# EAGLE design sphinkter (EAGLE 6.5.0)
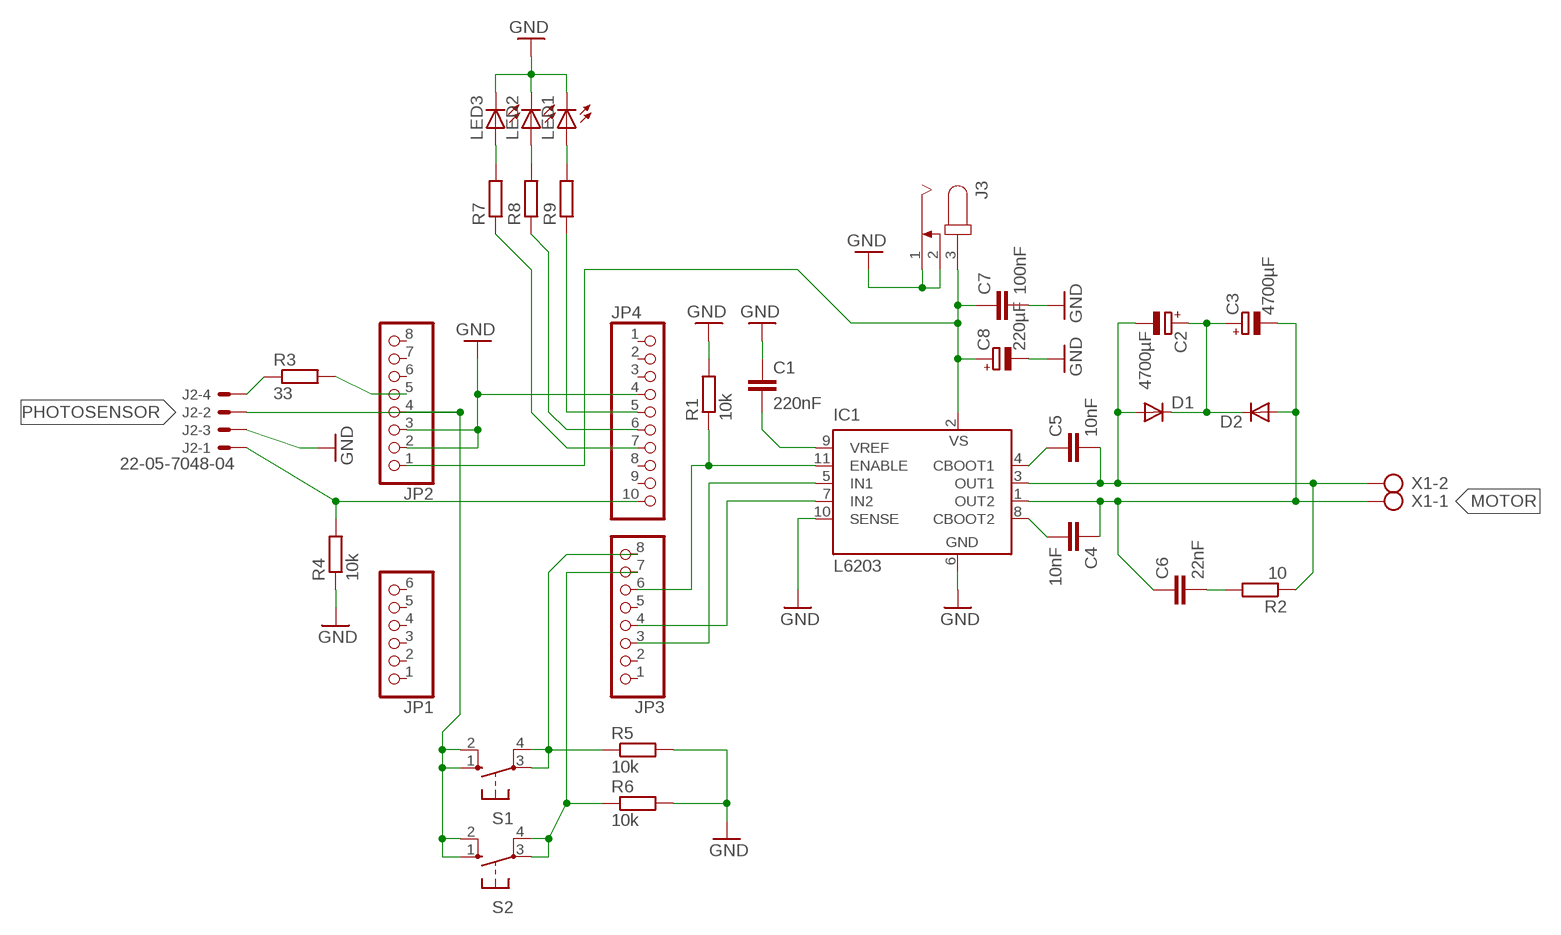
[diagram p0: schematic, sheet 1]

## Parts
C1  220nF  C-EU050-024X044  [C050-024X044]
C2  4700µF  CPOL-EUE7.5-16  [E7,5-16]
C3  4700µF  CPOL-EUE7.5-16  [E7,5-16]
C4  10nF  C-EU025-025X050  [C025-025X050]
C5  10nF  C-EU025-025X050  [C025-025X050]
C6  22nF  C-EU050-024X044  [C050-024X044]
C7  100nF  C-EU050-024X044  [C050-024X044]
C8  220µF  CPOL-EUE3.5-8  [E3,5-8]
D1  DIODE-DO27-15  [DO27-15]
D2  DIODE-DO27-15  [DO27-15]
IC1  L6203  [MULTIWATT-11]
J2  22-05-7048-04  [7395-04]
J3  JACK-PLUG0  [SPC4077]
JP1  PINHD-1X6  [1X06]
JP2  PINHD-1X8  [1X08]
JP3  PINHD-1X8  [1X08]
JP4  PINHD-1X10  [1X10]
LED1  LED5MM  [LED5MM]
LED2  LED5MM  [LED5MM]
LED3  LED5MM  [LED5MM]
R1  10k  R-EU_0207/10  [0207/10]
R2  10  R-EU_0207/10  [0207/10]
R3  33  R-EU_0207/10  [0207/10]
R4  10k  R-EU_0207/10  [0207/10]
R5  10k  R-EU_0207/10  [0207/10]
R6  10k  R-EU_0207/10  [0207/10]
R7  R-EU_0207/10  [0207/10]
R8  R-EU_0207/10  [0207/10]
R9  R-EU_0207/10  [0207/10]
S1  10-XX  [B3F-10XX]
S2  10-XX  [B3F-10XX]
X1  AK500/2  [AK500/2]

## Nets
5V_DETECTOR: JP2.5 R3.2
GND: C1.1 C7.2 C8.- IC1.6(GND) IC1.10(SENSE) J2.3 J3.1 J3.2 JP2.2 JP2.3 JP4.4 LED1.K(C) LED2.K(C) LED3.K(C) R1.2 R4.1 R5.2 R6.2
MOTOR: C3.- C4.1 C6.1 D2.A IC1.1(OUT2) X1.1
N$1: C1.2 IC1.9(VREF)
N$2: IC1.7(IN2) JP3.4
N$3: IC1.5(IN1) JP3.3
N$4: IC1.11(ENABLE) JP3.6 R1.1
N$5: C7.1 C8.+ IC1.2(VS) J3.3 JP2.1
N$6: C2.+ C3.+ D1.C D2.C
N$7: C4.2 IC1.8(CBOOT2)
N$8: C5.1 IC1.4(CBOOT1)
N$11: C6.2 R2.2
N$12: C2.- C5.2 D1.A IC1.3(OUT1) R2.1 X1.2
N$14: JP3.8 R5.1 S1.3(P) S1.4(P1)
N$16: JP3.7 R6.1 S2.3(P) S2.4(P1)
N$17: JP4.5 R9.1
N$18: LED3.A R7.2
N$19: LED2.A R8.2
N$20: LED1.A R9.2
N$21: JP4.6 R8.1
N$22: JP4.7 R7.1
N$24: J2.4 R3.1
PHOTOSENSOR: J2.2 JP2.4 S1.1(S) S1.2(S1) S2.1(S) S2.2(S1)
TO_ARDUINO: J2.1 JP4.10 R4.2
Unconnected: JP1.1 JP1.2 JP1.3 JP1.4 JP1.5 JP1.6 JP2.6 JP2.7 JP2.8 JP3.1 JP3.2 JP3.5 JP4.1 JP4.2 JP4.3 JP4.8 JP4.9

## Library data of the parts
C1 = rcl:C-EU: CAPACITOR, European symbol
C2 C3 C8 = resistor:CPOL-EU: POLARIZED CAPACITOR, European symbol
C4-C7 = resistor:C-EU: CAPACITOR, European symbol
D1 D2 = diode:DIODE-: DIODE
IC1 = st-microelectronics:L6203: DMOS FULL BRIDGE DRIVER; MPN: L6203; OC_FARNELL: 1467715; OC_NEWARK: 56P8434
J2 = con-molex:22-?-04: CONNECTOR wire to board 2.54 mm (.1 inch) pitch header; OC_FARNELL: unknown; OC_NEWARK: unknown
J3 = con-jack:JACK-PLUG: DC POWER JACK Power Jack, DC, Right Angle, Through Hole, Rated 5A at 16VDC, PC Terminals Distributor: Farnell (www.Farnell.de) Drawing: 84N1161.pdf / 84N1162.pdf Manufacturer: SPC Technology (www.spctechnology.com) Type: SPC4077 / SPC 4078; OC_FARNELL: unknown; OC_NEWARK: unknown
JP1 = pinhead:PINHD-1X6: PIN HEADER
JP2 JP3 = pinhead:PINHD-1X8: PIN HEADER
JP4 = pinhead:PINHD-1X10: PIN HEADER
LED1-LED3 = led:LED: LED OSRAM: - CHIPLED LG R971, LG N971, LY N971, LG Q971, LY Q971, LO R971, LY R971 LH N974, LH R974 LS Q976, LO Q976, LY Q976 LO Q996 - Hyper CHIPLED LW Q18S LB Q993, LB Q99A, LB R99A - SideLED LS A670, LO A670, LY A670, LG A670, LP A670 LB A673, LV A673, LT A673, LW A673 LH A674 LY A675 LS A676, LA A676, LO A676, LY A676, LW A676 LS A679, LY A679, LG A679 - Hyper Micro SIDELED® LS Y876, LA Y876, LO Y876, LY Y876 LT Y87S - SmartLED LW L88C, LW L88S LB L89C, LB L89S, LG L890 LS L89K, LO L89K, LY L89K LS L896, LA L896, LO L896, LY L896 - TOPLED LS T670, LO T670, LY T670, LG T670, LP T670 LSG T670, LSP T670, LSY T670, LOP T670, LYG T670 LG T671, LOG T671, LSG T671 LB T673, LV T673, LT T673, LW T673 LH T674 LS T676, LA T676, LO T676, LY T676, LB T676, LH T676, LSB T676, LW T676 LB T67C, LV T67C, LT T67C, LS T67K, LO T67K, LY T67K, LW E67C LS E67B, LA E67B, LO E67B, LY E67B, LB E67C, LV E67C, LT E67C LW T67C LS T679, LY T679, LG T679 LS T770, LO T770, LY T770, LG T770, LP T770 LB T773, LV T773, LT T773, LW T773 LH T774 LS E675, LA E675, LY E675, LS T675 LS T776, LA T776, LO T776, LY T776, LB T776 LHGB T686 LT T68C, LB T68C - Hyper Mini TOPLED® LB M676 - Mini TOPLED Santana® LG M470 LS M47K, LO M47K, LY M47K Source: http://www.osram.convergy.de LUXEON: - LUMILED® LXK2-PW12-R00, LXK2-PW12-S00, LXK2-PW14-U00, LXK2-PW14-V00 LXK2-PM12-R00, LXK2-PM12-S00, LXK2-PM14-U00 LXK2-PE12-Q00, LXK2-PE12-R00, LXK2-PE12-S00, LXK2-PE14-T00, LXK2-PE14-U00 LXK2-PB12-K00, LXK2-PB12-L00, LXK2-PB12-M00, LXK2-PB14-N00, LXK2-PB14-P00, LXK2-PB14-Q00 LXK2-PR12-L00, LXK2-PR12-M00, LXK2-PR14-Q00, LXK2-PR14-R00 LXK2-PD12-Q00, LXK2-PD12-R00, LXK2-PD12-S00 LXK2-PH12-R00, LXK2-PH12-S00 LXK2-PL12-P00, LXK2-PL12-Q00, LXK2-PL12-R00 Source: www.luxeon.com KINGBRIGHT: KA-3528ASYC Source: www.kingbright.com
R1-R9 = resistor:R-EU_: RESISTOR, European symbol
S1 S2 = switch-omron:10-XX: OMRON SWITCH; MPN: B3F-1000; OC_FARNELL: 176432; OC_NEWARK: 36M3542
X1 = con-ptr500:AK500/2: CONNECTOR; OC_FARNELL: unknown; OC_NEWARK: unknown

## Net classes
0 signal: width 0.5 mm
1 energy: width 1.5 mm

## Board
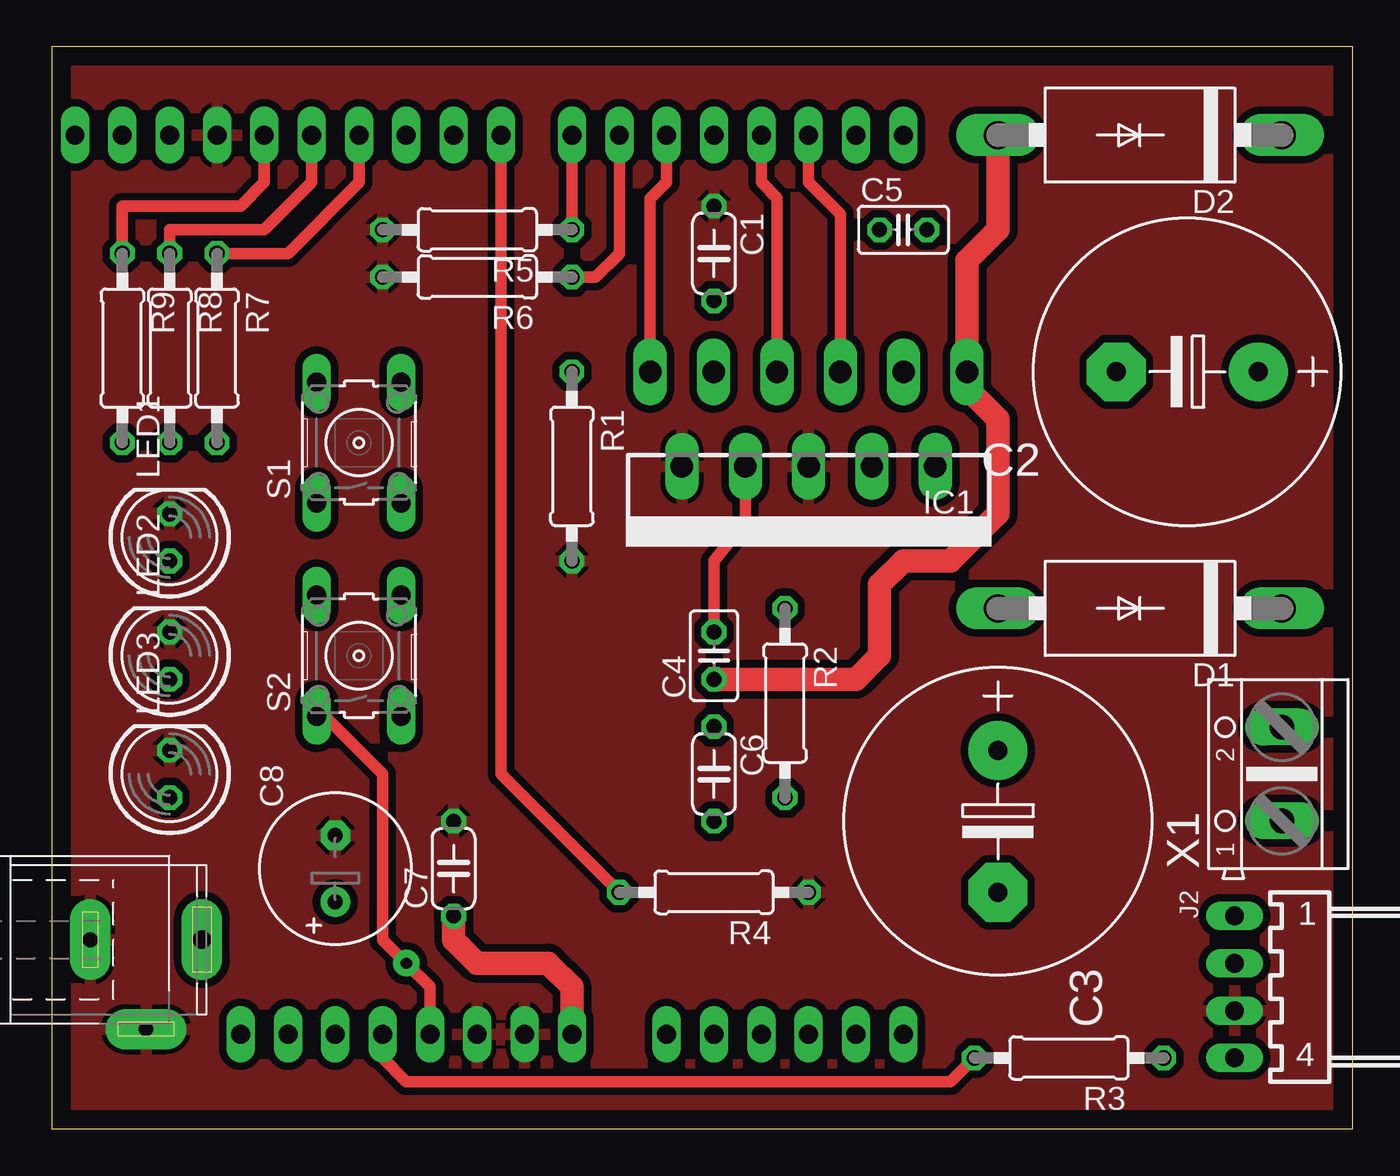
[diagram p1: board, top side]
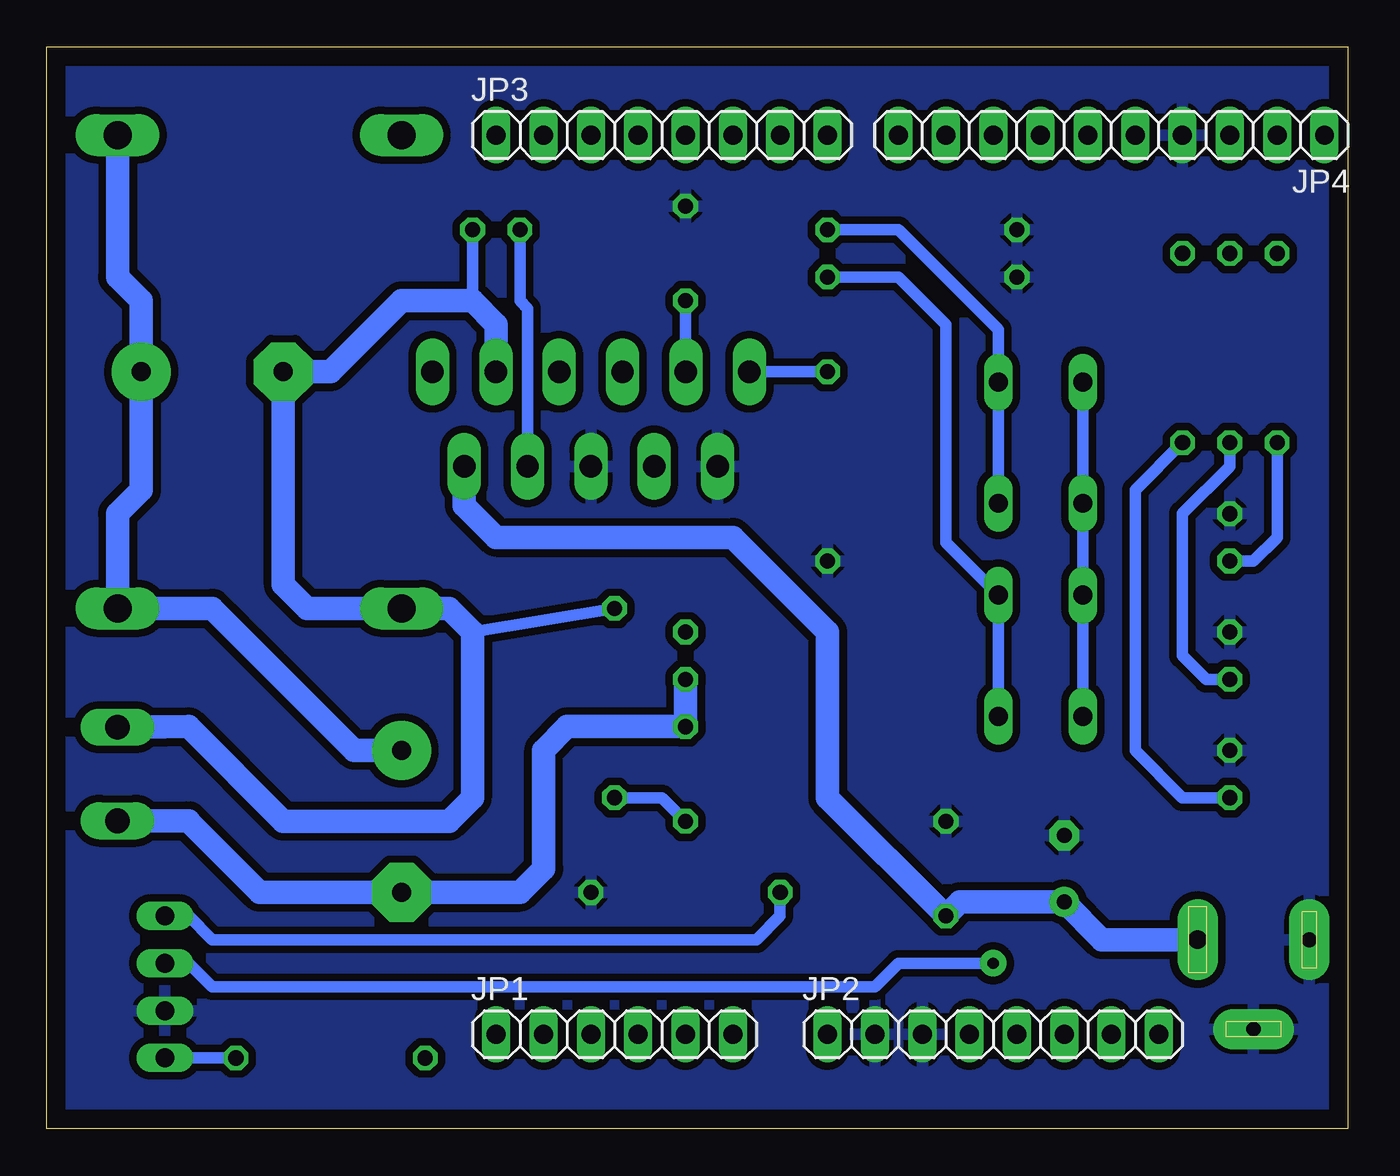
[diagram p2: board, bottom side, seen from below]

Size 69.84 x 58.09 mm. Coordinates in mm from the lower left corner, seen from the top.
Outline: 69.84,0 69.84,58.09 0,58.09 0,0 69.84,0
Copper layers (1*16): Top 0.035mm / dielectric 1.5mm / Bottom 0.035mm
Design rules "default": minimum track width 10mil, minimum drill 24mil, track to track 8mil, track to pad 8mil, pad to pad 8mil, via to via 8mil, smd to smd 8mil, copper to edge 40mil, drill to drill 8mil, minimum pad ring 10mil, minimum via ring 8mil, stop-mask expansion 4mil, vias tented up to drill 0mil, thermal gap 10mil

### Footprints (pad centres in the part's own frame; a part is rotated, then mirrored left to right if it is on the bottom)
C050-024X044 = drill 0.813 octagon: 1 -2.54,0; 2 2.54,0
E7,5-16 = drill 1.016 pad 3.15: + -3.81,0 | drill 1.016 pad 3.15 octagon: - 3.81,0
C025-025X050 = drill 0.813 octagon: 1 -1.27,0; 2 1.27,0
E3,5-8 = drill 0.813 pad 1.6: + -1.778,0 | drill 0.813 pad 1.6 octagon: - 1.778,0
DO27-15 = drill 1.499 long: A 7.62,0; C -7.62,0
MULTIWATT-11 = drill 1.2 long: 1 -8.5,-6.35; 2 -6.8,-1.27; 3 -5.1,-6.35; 4 -3.4,-1.27; 5 -1.7,-6.35; 6 0,-1.27; 7 1.7,-6.35; 8 3.4,-1.27; 9 5.1,-6.35; 10 6.8,-1.27; 11 8.5,-6.35
7395-04 = drill 1.016 long: 1 3.81,0; 2 1.27,0; 3 -1.27,0; 4 -3.81,0
SPC4077 = drill 0.8 pad 2.184 long: 1 -3,0; 2 0,-4.8 | drill 1 pad 2.184 long: 3 3,0
1X06 = drill 1.016 long: 1 -6.35,0; 2 -3.81,0; 3 -1.27,0; 4 1.27,0; 5 3.81,0; 6 6.35,0
1X08 = drill 1.016 long: 1 -8.89,0; 2 -6.35,0; 3 -3.81,0; 4 -1.27,0; 5 1.27,0; 6 3.81,0; 7 6.35,0; 8 8.89,0
1X10 = drill 1.016 long: 1 -11.43,0; 2 -8.89,0; 3 -6.35,0; 4 -3.81,0; 5 -1.27,0; 6 1.27,0; 7 3.81,0; 8 6.35,0; 9 8.89,0; 10 11.43,0
LED5MM = drill 0.813 octagon: A -1.27,0; K 1.27,0
0207/10 = drill 0.813 octagon: 1 -5.08,0; 2 5.08,0
B3F-10XX = drill 1.016 long: 1 -3.251,2.261; 2 3.251,2.261; 3 -3.251,-2.261; 4 3.251,-2.261
AK500/2 = drill 1.321 long: 1 -2.515,0; 2 2.515,0

### Placement (x,y rotation side)
C1  35.55,46.99 270 top
C2  60.95,40.64 180 top
C3  50.79,16.51 270 top
C4  35.55,25.4 90 top
C5  45.71,48.26 0 top
C6  35.55,19.05 270 top
C7  21.58,13.97 90 top
C8  15.23,13.97 90 top
D1  58.41,27.94 180 top
D2  58.41,53.34 180 top
IC1  40.63,34.29 180 top
J2  63.49,7.62 90 top
J3  5.07,10.16 0 top
JP1  39.36,5.08 0 bottom
JP2  19.04,5.08 0 bottom
JP3  36.82,53.34 0 bottom
JP4  12.69,53.34 180 bottom
LED1  6.34,31.75 90 top
LED2  6.34,25.4 90 top
LED3  6.34,19.05 90 top
R1  27.93,35.56 270 top
R2  39.36,22.86 270 top
R3  54.6,3.81 180 top
R4  35.55,12.7 180 top
R5  22.85,48.26 180 top
R6  22.85,45.72 180 top
R7  8.88,41.91 270 top
R8  6.34,41.91 270 top
R9  3.8,41.91 270 top
S1  16.5,36.83 90 top
S2  16.5,25.4 90 top
X1  66.03,19.05 90 top

### Tracks (layer width: path | path; a pad name or v marks a point on that pad's centre or on a via)
5V_DETECTOR
  Top 0.61: R3.2 48.25,2.54 19.04,2.54 17.77,3.81 JP2.5
GND
  pour Bottom (isolate 0.406): -0.01,58.42 69.84,58.42 69.84,0 -0.01,0
  pour Top (isolate 0.406): -0.01,58.42 69.84,58.42 69.84,0 -0.01,0
MOTOR
  Top 1.27: D2.A 50.79,48.26 49.13,46.6 IC1.1 49.13,39.76 50.79,38.1 50.79,33.02 48.25,30.48 45.71,30.48 44.44,29.21 44.44,25.4 43.17,24.13 C4.1
  Bottom 1.27: C4.1 C6.1 41.9,21.59 43.17,20.32 43.17,13.97 44.44,12.7 C3.- 58.41,12.7 62.22,16.51 62.22,16.54 X1.1
N$1
  Bottom 0.61: C1.2 35.55,40.66 IC1.9
N$2
  Top 0.61: IC1.7 38.93,49.96 38.09,50.8 JP3.4
N$3
  Top 0.61: IC1.5 42.33,49.1 40.63,50.8 JP3.3
N$4
  Top 0.61: IC1.11 32.13,49.92 33.01,50.8 JP3.6
  Bottom 0.61: R1.1 IC1.11
N$5
  Top 1.27: C7.1 21.58,10.16 22.85,8.89 26.66,8.89 27.93,7.62 JP2.1
  Bottom 1.27: J3.3 13.2,10.16 C8.+ 20.82,12.19 C7.1 27.93,17.78 27.93,26.67 33.01,31.75 45.71,31.75 47.43,33.47 IC1.2
N$6
  Bottom 1.27: D2.C 66.03,45.72 64.76,44.45 C2.+ 64.76,34.29 66.03,33.02 D1.C 60.95,27.94 53.33,20.32 C3.+
N$7
  Top 0.61: IC1.8 37.23,32.61 35.55,30.48 C4.2
N$8
  Bottom 0.61: IC1.4 44.03,44.04 44.44,44.45 C5.1
N$11
  Bottom 0.61: R2.2 36.82,17.78 C6.2
N$12
  Bottom 0.61: C5.2 46.98,44.45 | R2.1 46.98,26.67
  Bottom 1.27: IC1.3 45.71,40.66 45.71,43.18 46.98,44.45 50.79,44.45 54.6,40.64 C2.- 57.14,29.21 55.87,27.94 D1.A 48.25,27.94 46.98,26.67 46.98,17.78 48.25,16.51 57.14,16.51 62.22,21.59 63.52,21.57 X1.2
N$14
  Top 0.61: JP3.8 R5.1
  Bottom 0.61: R5.1 24.12,48.26 18.76,42.9 S1.4 S1.3
N$16
  Top 0.61: JP3.7 30.47,46.99 29.2,45.72 R6.1
  Bottom 0.61: R6.1 24.12,45.72 21.58,43.18 21.58,31.47 S2.4 S2.3
N$17
  Top 0.61: R9.1 3.8,49.53 10.15,49.53 11.42,50.8 JP4.5
N$18
  Bottom 0.61: R7.2 11.42,34.29 11.42,20.32 8.88,17.78 LED3.A
N$19
  Bottom 0.61: R8.2 6.34,35.56 8.88,33.02 8.88,25.4 7.61,24.13 LED2.A
N$20
  Bottom 0.61: R9.2 3.8,31.75 5.07,30.48 LED1.A
N$21
  Top 0.61: R8.1 6.34,48.26 11.42,48.26 13.96,50.8 JP4.6
N$22
  Top 0.61: R7.1 12.69,46.99 16.5,50.8 JP4.7
N$24
  Bottom 0.61: R3.1 J2.4
PHOTOSENSOR  (via drill 0.6 pad 1.42)
  Top 0.61: JP2.4 20.31,7.62 v19.04,8.89 17.77,10.16 17.77,19.05 14.67,22.15 S2.1
  Bottom 0.61: S1.2 S1.1 S2.2 S2.1 | J2.2 62.22,8.89 60.95,7.62 25.39,7.62 24.12,8.89 v19.04,8.89
TO_ARDUINO
  Top 0.61: JP4.10 24.12,19.05 R4.2
  Bottom 0.61: J2.1 62.22,11.43 60.95,10.16 31.74,10.16 30.47,11.43 R4.2